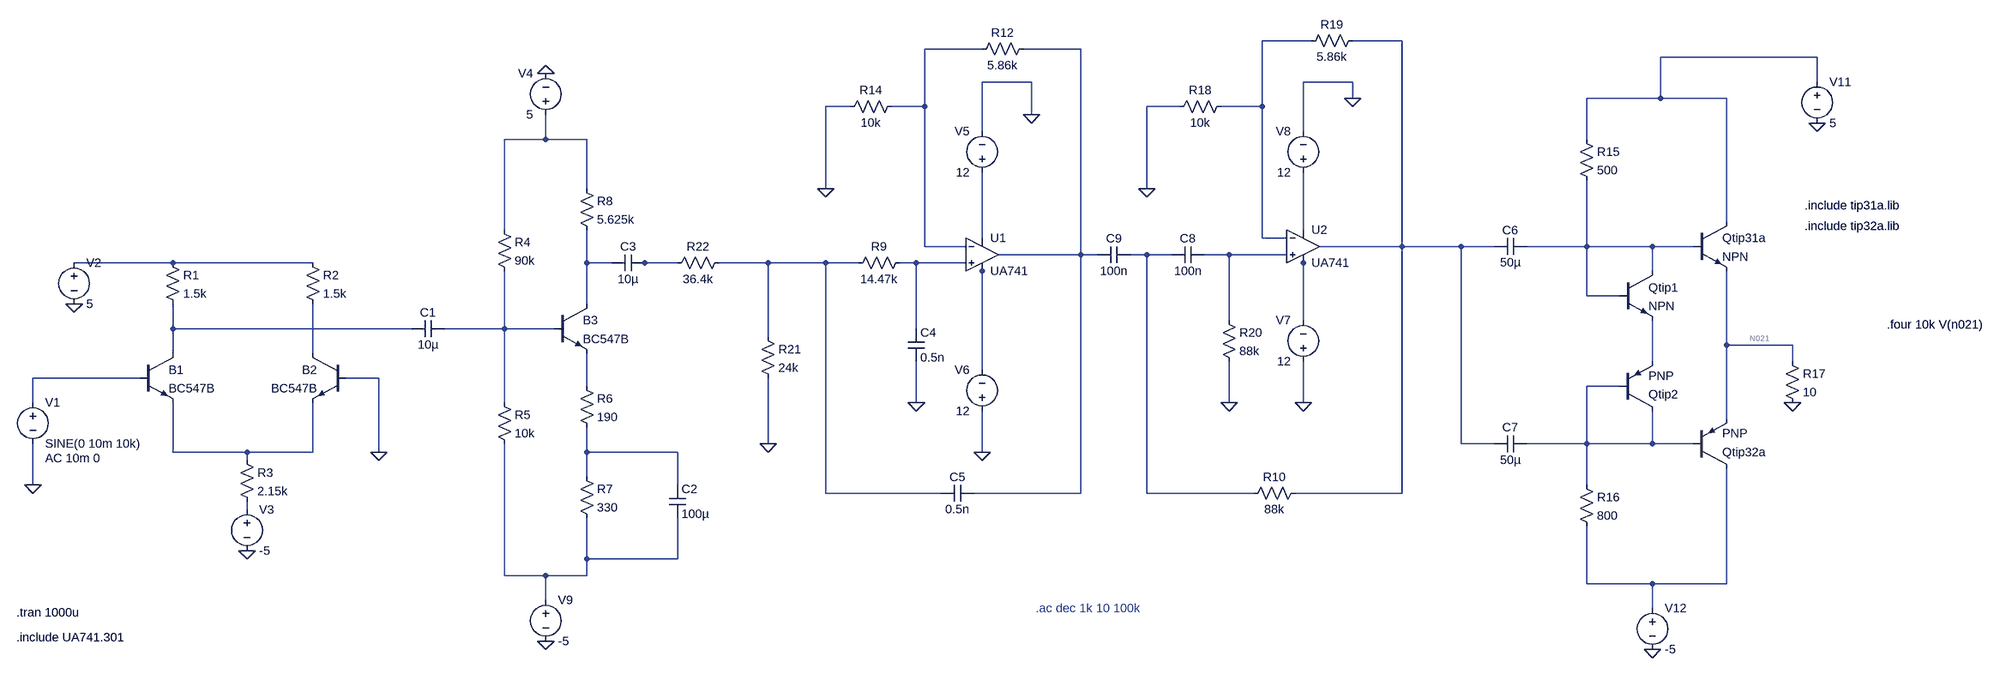
[diagram p0: schematic Audio_Amplifier_v4.asc]
Audio_Amplifier_v4.asc, the LTspice schematic file:
Version 4.1
SHEET 1 5036 884
WIRE 2240 -320 2144 -320
WIRE 2416 -320 2320 -320
WIRE 1600 -304 1488 -304
WIRE 1792 -304 1680 -304
WIRE 3296 -288 2992 -288
WIRE 1696 -240 1600 -240
WIRE 2320 -240 2224 -240
WIRE 3296 -240 3296 -288
WIRE 2320 -208 2320 -240
WIRE 2992 -208 2992 -288
WIRE 2992 -208 2848 -208
WIRE 3120 -208 2992 -208
WIRE 1344 -192 1296 -192
WIRE 1488 -192 1488 -304
WIRE 1488 -192 1424 -192
WIRE 1984 -192 1920 -192
WIRE 2144 -192 2144 -320
WIRE 2144 -192 2064 -192
WIRE 1696 -176 1696 -240
WIRE 1600 -144 1600 -240
WIRE 2224 -144 2224 -240
WIRE 752 -128 752 -176
WIRE 752 -128 672 -128
WIRE 832 -128 752 -128
WIRE 2848 -128 2848 -208
WIRE 832 -32 832 -128
WIRE 1296 -32 1296 -192
WIRE 1920 -32 1920 -192
WIRE 3120 32 3120 -208
WIRE 672 48 672 -128
WIRE 2224 48 2224 -64
WIRE 1600 64 1600 -64
WIRE 2144 64 2144 -192
WIRE 2192 64 2144 64
WIRE 1488 80 1488 -192
WIRE 1568 80 1488 80
WIRE 2416 80 2416 -320
WIRE 2416 80 2256 80
WIRE 2544 80 2416 80
WIRE 2608 80 2544 80
WIRE 2848 80 2848 -48
WIRE 2848 80 2672 80
WIRE 2976 80 2848 80
WIRE 3056 80 2976 80
WIRE 1792 96 1792 -304
WIRE 1792 96 1632 96
WIRE 1824 96 1792 96
WIRE 1920 96 1888 96
WIRE 1968 96 1920 96
WIRE 2080 96 2032 96
WIRE 2192 96 2080 96
WIRE -16 112 -208 112
WIRE 256 112 -16 112
WIRE 832 112 832 48
WIRE 880 112 832 112
WIRE 944 112 928 112
WIRE 1008 112 944 112
WIRE 1184 112 1088 112
WIRE 1296 112 1184 112
WIRE 1360 112 1296 112
WIRE 1472 112 1440 112
WIRE 1568 112 1472 112
WIRE 2224 112 2224 96
WIRE 1600 128 1600 112
WIRE 2976 128 2976 80
WIRE 2848 176 2848 80
WIRE 2912 176 2848 176
WIRE 832 192 832 112
WIRE 2080 224 2080 96
WIRE 2224 224 2224 112
WIRE -16 240 -16 192
WIRE 448 240 -16 240
WIRE 672 240 672 128
WIRE 672 240 512 240
WIRE 768 240 672 240
WIRE 1472 240 1472 112
WIRE 1184 256 1184 112
WIRE 3120 272 3120 128
WIRE 3248 272 3120 272
WIRE -16 288 -16 240
WIRE 256 288 256 192
WIRE 2976 304 2976 224
WIRE 3248 304 3248 272
WIRE 1600 320 1600 128
WIRE -80 336 -288 336
WIRE 384 336 320 336
WIRE 832 352 832 288
WIRE 2912 352 2848 352
WIRE -288 384 -288 336
WIRE 672 384 672 240
WIRE 1472 384 1472 304
WIRE 2080 384 2080 304
WIRE 2224 384 2224 304
WIRE 3120 416 3120 272
WIRE 1184 464 1184 336
WIRE 2544 464 2544 80
WIRE 2608 464 2544 464
WIRE 2848 464 2848 352
WIRE 2848 464 2672 464
WIRE 2976 464 2976 400
WIRE 2976 464 2848 464
WIRE 3056 464 2976 464
WIRE -16 480 -16 384
WIRE 128 480 -16 480
WIRE 256 480 256 384
WIRE 256 480 128 480
WIRE 384 480 384 336
WIRE 832 480 832 432
WIRE 1008 480 832 480
WIRE 1600 480 1600 400
WIRE 128 496 128 480
WIRE 832 528 832 480
WIRE -288 544 -288 464
WIRE 1008 544 1008 480
WIRE 2848 544 2848 464
WIRE 1296 560 1296 112
WIRE 1520 560 1296 560
WIRE 1792 560 1792 96
WIRE 1792 560 1584 560
WIRE 1920 560 1920 96
WIRE 2128 560 1920 560
WIRE 2416 560 2416 80
WIRE 2416 560 2208 560
WIRE 128 592 128 576
WIRE 832 688 832 608
WIRE 1008 688 1008 608
WIRE 1008 688 832 688
WIRE 672 720 672 464
WIRE 752 720 672 720
WIRE 832 720 832 688
WIRE 832 720 752 720
WIRE 2848 736 2848 624
WIRE 2976 736 2848 736
WIRE 3120 736 3120 512
WIRE 3120 736 2976 736
WIRE 752 768 752 720
WIRE 2976 784 2976 736
FLAG -208 192 0
FLAG 128 672 0
FLAG 384 480 0
FLAG -288 544 0
FLAG 752 848 0
FLAG 3248 384 0
FLAG 3296 -160 0
FLAG 2976 864 0
FLAG 1600 480 0
FLAG 2224 384 0
FLAG 2320 -208 0
FLAG 1696 -176 0
FLAG 1472 384 0
FLAG 1296 -32 0
FLAG 1920 -32 0
FLAG 2080 384 0
FLAG 1184 464 0
FLAG 752 -256 0
SYMBOL npn -80 288 R0
SYMATTR InstName B1
SYMATTR Value BC547B
SYMBOL npn 320 288 M0
SYMATTR InstName B2
SYMATTR Value BC547B
SYMBOL res -32 96 R0
SYMATTR InstName R1
SYMATTR Value 1.5k
SYMBOL res 240 96 R0
SYMATTR InstName R2
SYMATTR Value 1.5k
SYMBOL res 112 480 R0
SYMATTR InstName R3
SYMATTR Value 2.15k
SYMBOL voltage -208 96 R0
WINDOW 123 0 0 Left 0
WINDOW 39 0 0 Left 0
SYMATTR InstName V2
SYMATTR Value 5
SYMBOL voltage 128 576 R0
WINDOW 123 0 0 Left 0
WINDOW 39 0 0 Left 0
SYMATTR InstName V3
SYMATTR Value -5
SYMBOL voltage -288 368 R0
WINDOW 123 24 124 Left 2
WINDOW 39 0 0 Left 0
SYMATTR Value2 AC 10m 0
SYMATTR InstName V1
SYMATTR Value SINE(0 10m 10k)
SYMBOL npn 768 192 R0
SYMATTR InstName B3
SYMATTR Value BC547B
SYMBOL res 656 32 R0
SYMATTR InstName R4
SYMATTR Value 90k
SYMBOL res 656 368 R0
SYMATTR InstName R5
SYMATTR Value 10k
SYMBOL voltage 752 -160 R180
WINDOW 0 24 96 Left 2
WINDOW 3 24 16 Left 2
WINDOW 123 0 0 Left 0
WINDOW 39 0 0 Left 0
SYMATTR InstName V4
SYMATTR Value 5
SYMBOL res 816 -48 R0
SYMATTR InstName R8
SYMATTR Value 5.625k
SYMBOL cap 512 224 R90
WINDOW 0 0 32 VBottom 2
WINDOW 3 32 32 VTop 2
SYMATTR InstName C1
SYMATTR Value 10µ
SYMBOL voltage 752 752 R0
WINDOW 123 0 0 Left 0
WINDOW 39 0 0 Left 0
SYMATTR InstName V9
SYMATTR Value -5
SYMBOL cap 944 96 R90
WINDOW 0 0 32 VBottom 2
WINDOW 3 32 32 VTop 2
SYMATTR InstName C3
SYMATTR Value 10µ
SYMBOL cap 2672 64 R90
WINDOW 0 0 32 VBottom 2
WINDOW 3 32 32 VTop 2
SYMATTR InstName C6
SYMATTR Value 50µ
SYMBOL cap 2672 448 R90
WINDOW 0 0 32 VBottom 2
WINDOW 3 32 32 VTop 2
SYMATTR InstName C7
SYMATTR Value 50µ
SYMBOL res 2832 -144 R0
SYMATTR InstName R15
SYMATTR Value 500
SYMBOL res 2832 528 R0
SYMATTR InstName R16
SYMATTR Value 800
SYMBOL npn 3056 32 R0
SYMATTR InstName Qtip31a
SYMBOL voltage 3296 -256 R0
WINDOW 123 0 0 Left 0
WINDOW 39 0 0 Left 0
SYMATTR InstName V11
SYMATTR Value 5
SYMBOL res 3232 288 R0
SYMATTR InstName R17
SYMATTR Value 10
SYMBOL pnp 3056 512 M180
SYMATTR InstName Qtip32a
SYMBOL voltage 2976 768 R0
WINDOW 123 0 0 Left 0
WINDOW 39 0 0 Left 0
SYMATTR InstName V12
SYMATTR Value -5
SYMBOL res 816 336 R0
SYMATTR InstName R6
SYMATTR Value 190
SYMBOL OpAmps\\opamp2 1600 32 R0
SYMATTR InstName U1
SYMATTR Value UA741
SYMBOL voltage 1600 -48 R180
WINDOW 0 24 96 Left 2
WINDOW 3 24 16 Left 2
SYMATTR InstName V5
SYMATTR Value 12
SYMBOL voltage 1600 416 R180
WINDOW 0 24 96 Left 2
WINDOW 3 24 16 Left 2
SYMATTR InstName V6
SYMATTR Value 12
SYMBOL OpAmps\\opamp2 2224 16 R0
SYMATTR InstName U2
SYMATTR Value UA741
SYMBOL voltage 2224 320 R180
WINDOW 0 24 96 Left 2
WINDOW 3 24 16 Left 2
SYMATTR InstName V7
SYMATTR Value 12
SYMBOL voltage 2224 -48 R180
WINDOW 0 24 96 Left 2
WINDOW 3 24 16 Left 2
SYMATTR InstName V8
SYMATTR Value 12
SYMBOL res 1456 96 R90
WINDOW 0 0 56 VBottom 2
WINDOW 3 32 56 VTop 2
SYMATTR InstName R9
SYMATTR Value 14.47k
SYMBOL cap 1456 240 R0
SYMATTR InstName C4
SYMATTR Value 0.5n
SYMBOL cap 1584 544 R90
WINDOW 0 0 32 VBottom 2
WINDOW 3 32 32 VTop 2
SYMATTR InstName C5
SYMATTR Value 0.5n
SYMBOL cap 2032 80 R90
WINDOW 0 0 32 VBottom 2
WINDOW 3 32 32 VTop 2
SYMATTR InstName C8
SYMATTR Value 100n
SYMBOL cap 1888 80 R90
WINDOW 0 0 32 VBottom 2
WINDOW 3 32 32 VTop 2
SYMATTR InstName C9
SYMATTR Value 100n
SYMBOL res 2224 544 R90
WINDOW 0 0 56 VBottom 2
WINDOW 3 32 56 VTop 2
SYMATTR InstName R10
SYMATTR Value 88k
SYMBOL res 1696 -320 R90
WINDOW 0 0 56 VBottom 2
WINDOW 3 32 56 VTop 2
SYMATTR InstName R12
SYMATTR Value 5.86k
SYMBOL res 1440 -208 R90
WINDOW 0 0 56 VBottom 2
WINDOW 3 32 56 VTop 2
SYMATTR InstName R14
SYMATTR Value 10k
SYMBOL res 2080 -208 R90
WINDOW 0 0 56 VBottom 2
WINDOW 3 32 56 VTop 2
SYMATTR InstName R18
SYMATTR Value 10k
SYMBOL res 2336 -336 R90
WINDOW 0 0 56 VBottom 2
WINDOW 3 32 56 VTop 2
SYMATTR InstName R19
SYMATTR Value 5.86k
SYMBOL res 2064 208 R0
SYMATTR InstName R20
SYMATTR Value 88k
SYMBOL res 1168 240 R0
SYMATTR InstName R21
SYMATTR Value 24k
SYMBOL res 1104 96 R90
WINDOW 0 0 56 VBottom 2
WINDOW 3 32 56 VTop 2
SYMATTR InstName R22
SYMATTR Value 36.4k
SYMBOL res 816 512 R0
SYMATTR InstName R7
SYMATTR Value 330
SYMBOL cap 992 544 R0
SYMATTR InstName C2
SYMATTR Value 100µ
SYMBOL npn 2912 128 R0
SYMATTR InstName Qtip1
SYMBOL pnp 2912 400 M180
SYMATTR InstName Qtip2
TEXT -320 792 Left 2 !.tran 1000u
TEXT -320 840 Left 2 !.include UA741.301
TEXT 3272 0 Left 2 !.include tip31a.lib
TEXT 3272 40 Left 2 !.include tip32a.lib
TEXT 1704 784 Left 2 ;.ac dec 1k 10 100k
TEXT 3432 232 Left 2 !.four 10k V(n021)

The netlist it stands for:
* Audio_Amplifier_v4.asc
Q§B1 N019 N024 N027 0 BC547B
Q§B2 N022 0 N027 0 BC547B
R1 N012 N019 1.5k
R2 N012 N022 1.5k
R3 N027 N029 2.15k
V2 N012 0 5
V3 N029 0 -5
V1 N024 0 SINE(0 10m 10k) AC 10m 0
Q§B3 N013 N020 N025 0 BC547B
R4 N006 N020 90k
R5 N020 N030 10k
V4 N006 0 5
R8 N006 N013 5.625k
C1 N020 N019 10µ
V9 N030 0 -5
C3 N014 N013 10µ
C6 N009 N002 50µ
C7 N026 N002 50µ
R15 N005 N009 500
R16 N026 N031 800
Qtip31a N005 N009 N021 0 NPN
V11 N005 0 5
R17 N021 0 10
Qtip32a N031 N026 N021 0 PNP
V12 N031 0 -5
R6 N025 N028 190
X§U1 N016 N003 N008 N018 N004 UA741  ; pins In+ In- V+ V- OUT
V5 N008 0 12
V6 0 N018 12
X§U2 N011 N001 N007 N017 N002 UA741  ; pins In+ In- V+ V- OUT
V7 0 N017 12
V8 N007 0 12
R9 N016 N015 14.47k
C4 N016 0 0.5n
C5 N004 N015 0.5n
C8 N011 N010 100n
C9 N010 N004 100n
R10 N002 N010 88k
R12 N004 N003 5.86k
R14 N003 0 10k
R18 N001 0 10k
R19 N002 N001 5.86k
R20 N011 0 88k
R21 N015 0 24k
R22 N015 N014 36.4k
R7 N028 N030 330
C2 N028 N030 100µ
Qtip1 N009 N009 N023 0 NPN
Qtip2 N026 N026 N023 0 PNP
.model NPN NPN
.model PNP PNP
.lib standard.bjt
.tran 1000u
.include UA741.301
.include tip31a.lib
.include tip32a.lib
* .ac dec 1k 10 100k
.four 10k V(n021)
.backanno
.end